# Altium project MagLev.PrjPcb
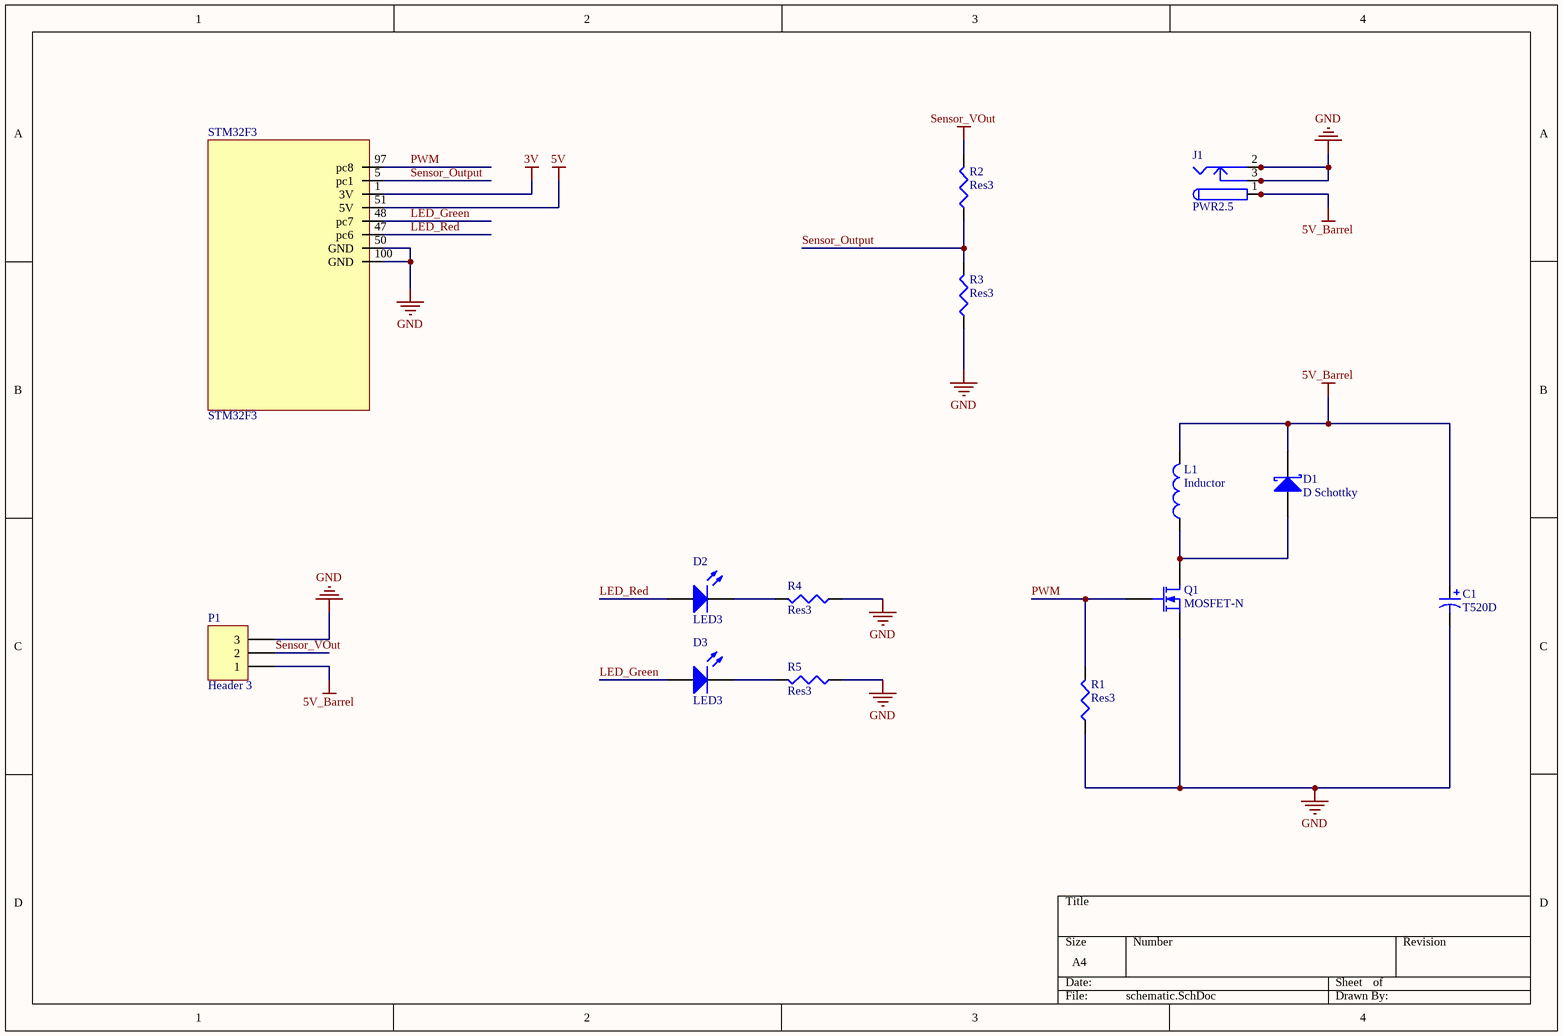
[diagram p0: schematic.SchDoc]
1 sheet, 14 parts. Net scope: global (net labels, ports and power ports of the same name join across sheets).
Board file: PCB.PcbDoc

## Sheet schematic.SchDoc
size A4

### Parts
C1  T520D  [D]
D1  D Schottky  [SMB]
D2  LED3  [3.5X2.8X1.9]
D3  LED3  [3.5X2.8X1.9]
J1  PWR2.5  [KLD-0202]
L1  Inductor  [0402-A]
P1  Header 3  [HDR1X3]
Q1  MOSFET-N  [E3]
R1  Res3  [J1-0603]
R2  Res3  [J1-0603]
R3  Res3  [J1-0603]
R4  Res3  [J1-0603]
R5  Res3  [J1-0603]
STM32F3  STM32F3  [STM32_MagLev]

### Nets
3V: STM32F3.1(3V)
5V: STM32F3.51(5V)
5V_Barrel: C1.1 D1.2(K) J1.1 J1.1A J1.1B L1.2 P1.1
GND: C1.2 J1.2 J1.2A J1.2B J1.3 J1.3A J1.3B P1.3 Q1.3(S) R1.1 R3.1 R4.1 R5.1 STM32F3.50(GND) STM32F3.100(GND)
Sensor_VOut: P1.2 R2.2
LED_Green: D3.1(A) STM32F3.48(pc7)
LED_Red: D2.1(A) STM32F3.47(pc6)
PWM: Q1.2(G) R1.2 STM32F3.97(pc8)
Sensor_Output: R2.1 R3.2 STM32F3.5(pc1)
NetD1_1: D1.1(A) L1.1 Q1.1(D)
NetD2_2: D2.2(K) R4.2
NetD3_2: D3.2(K) R5.2

### Library data of the parts
C1 = T520D: Polymer Tantalum Chip Capacitor, T520 Series - KO-CAP Polymer; Value: 100pF; Published: 17-Jul-2002; LatestRevisionDate: 19-Mar-2004; LatestRevisionNote: Silkscreen dimensions re-sized.; DatasheetDocument: Mar-2001; PackageDocument: Mar-2001; PackageReference: D; Publisher: Altium Limited; Code_JEITA: 7343-31; ComponentLink1Description: Manufacturer Link; ComponentLink1URL: http://www.kemet.com/; ComponentLink2Description: Datasheet; ComponentLink2URL: http://www.kemet.com/kemet/web/homepage/kechome.nsf/vapubfilesname/F3102TA.pdf/$file/F3102TA.pdf
D1 = D Schottky: Schottky Diode; Published: 8-Jun-2000; LatestRevisionDate: 17-Jul-2002; LatestRevisionNote: Re-released for DXP Platform.; PackageReference: SMB; Publisher: Altium Limited; PackageDescription: DO-214-AA/SMB; 2 C-Bend Leads; Body 5.3 x 3.6 mm, inc. leads (LxW); Code_JEDEC: DO-214-AA
D2 D3 = LED3: Typical BLUE SiC LED; Published: 8-Jun-2000; LatestRevisionDate: 17-Dec-2003; LatestRevisionNote: PCB Footprint replaced.; DatasheetVersion: 16-Apr-2002; PackageVersion: 16-Apr-2002; PackageReference: 3.5X2.8X1.9; Publisher: Altium Limited; PackageDescription: SM LED; 2 C-Bend Leads; Body 3.5 x 2.8 x 1.9 mm, inc leads (LxWxH typ)
J1 = PWR2.5: Low Voltage Power Supply Connector; Published: 17-Dec-2003; DatasheetDocument: 09-May-2002; Publisher: Altium Limited; ComponentLink1Description: Manufacturer Link; ComponentLink1URL: http://domino.kycon.com/internet/Products.html
L1 = Inductor: Code_IEC: 1005; Value: 10mH; Published: 8-Jun-2000; LatestRevisionDate: 29-May-2009; LatestRevisionNote: IPC-7351 Footprint Added.; PackageReference: 0402-A; Publisher: Altium Limited; PackageDescription: Chip Inductor; Code_JEITA: 0402
P1 = Header 3: Header, 3-Pin; LatestRevisionDate: 17-Jul-2002; LatestRevisionNote: Re-released for DXP Platform.; Publisher: Altium Limited
Q1 = MOSFET-N: N-Channel MOSFET; Published: 8-Jun-2000; LatestRevisionDate: 17-Jul-2002; LatestRevisionNote: Re-released for DXP Platform.; PackageVersion: 1995/1996; PackageReference: E3; Publisher: Altium Limited; PackageDescription: TO, Flat Index; 3 In-Line, Axial Leads; Body Dia. 4.6mm; Lead Dia. 0.5 mm (max)
R1-R5 = Res3: Resistor; Value: 1K; Published: 8-Jun-2000; LatestRevisionDate: 29-May-2009; LatestRevisionNote: IPC-7351 Footprint Added.; PackageReference: J1-0603; Publisher: Altium Limited; PackageDescription: Chip Resistor
STM32F3 = STM32F3: STM32F3 base